# Altium schematic sheet RS232.SchDoc: RS-232
size A4; Date: 30 08 2013; Author: Rachid AKKOUCHE; CompanyName: RASoftware; DrawnBy: Rachid AKKOUCHE; Address1: 52 J03 rue de la crèche; Address2: 77100 MEAUX; Address3: FRANCE; DocumentNumber: BRA201308305C; Revision: C; SheetNumber: 5; SheetTotal: 11; Telephone: +33651604047; Email: rachid.akkouche@wanadoo.fr; Proprietaire: MDI System; Dessinepar: -; Verifiepar: -; Time: 19:00
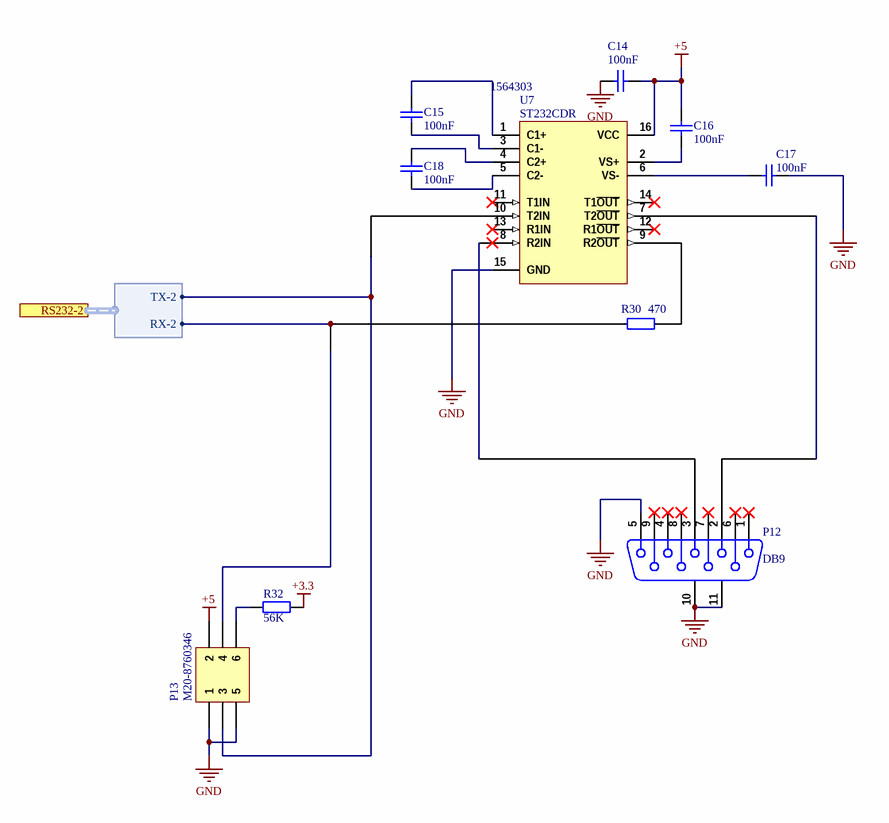
[diagram p0: RS232.SchDoc]

## Parts
C14  100nF  [C0805]  (no BOM)
C15  100nF  [C0805]  (no BOM)
C16  100nF  [C0805]  (no BOM)
C17  100nF  [C0805]  (no BOM)
C18  100nF  [C0805]  (no BOM)
P12  DB9  [SUBD9_F_V]  (no BOM)
P13  M20-8760346  [M20-2X3]  (no BOM)
R30  470  [R0805]  (no BOM)
R32  56K  [R0805]  (no BOM)
U7  ST232CDR  Supplier Part Number 1: 1564303  [SO-16]  (no BOM)

## Ports
RS232-2 (harness RS232_2)

## Harnesses
RS232_2: TX-2, RX-2

## Nets
+3.3: R32.2
+5: C14.1 C16.2 P13.2 U7.16(VCC)
GND: C14.2 C17.1 P12.5 P12.10(MH1) P12.11(MH2) P13.1 P13.5 U7.15(GND)
NetC15_1: C15.1 U7.3(C1-)
NetC15_2: C15.2 U7.1(C1+)
NetC16_1: C16.1 U7.2(VS+)
NetC17_2: C17.2 U7.6(VS-)
NetC18_1: C18.1 U7.5(C2-)
NetC18_2: C18.2 U7.4(C2+)
NetP12_2: P12.2 U7.7(T2~{OUT})
NetP12_3: P12.3 U7.8(R2IN)
NetP13_3: P13.3 U7.10(T2IN) ; port RS232-2.TX-2
NetP13_4: P13.4 R30.1 ; port RS232-2.RX-2
NetP13_6: P13.6 R32.1
NetR30_2: R30.2 U7.9(R2~{OUT})

Not connected (* = marked no-connect by the designer): P12 1* 4* 6* 7* 8* 9*; U7 11(T1IN)* 12(R1~{OUT})* 13(R1IN)* 14(T1~{OUT})*

## Notes on the sheet
- Ce document est la propriété de
- Project:
- Il ne peut être divulgué sans l'accord écrit de l'un de ses représentants dûment mandaté
- Title:
- Number:
- Date:
- Time:
- Size:
- A4
- Revision:
- Sheet
- of
- 52 J03 rue de la crèche
- Draw by:
- 77100 Meaux

## Library data of the parts
C14-C18 = Cap: Capacitor; Manufacturer: MULTICOMP; Manufacturer Part Number: MCCA000296; Supplier 1: Farnell; Supplier Part Number 1: 1759167; Stock 1: 225269; Pricing 1: 100=0,01, 500=0,008, 1000=0,006, 4000=0,005 (EUR); ComponentLink1URL: http://www.farnell.com/datasheets/1520827.pdf; ComponentLink1Description: http://www.farnell.com/datasheets/1520827.pdf
P12 = D Connector 9: Receptacle Assembly, 9 Position, Right Angle; Manufacturer: TE CONNECTIVITY / AMP; Manufacturer Part Number: 2-338313-2; Type de connecteur: Sub-D; Série: HDP-20; Genre: Embase; Nombre de contacts: 9; Nombre de rangées: 2; Plaquage du contact: Or; Matériau du contact: Bronze phosphoreux; Méthode de terminaison: A souder; Supplier 1: Farnell; Supplier Part Number 1: 1772804; RoHS: YES; Stock 1: 500; Pricing 1: 10=5,54, 50=5,31, 100=5,09, 250=4,63, 500=4,25 (EUR); ComponentLink1URL: http://www.tycoelectronics.com/commerce/DocumentDelivery/DDEController?Action=srchrtrv&DocNm=2-338313-2&DocType=Customer+View+Model&DocLang=English; ComponentLink1Description: http://www.tycoelectronics.com/commerce/DocumentDelivery/DDEController?Action=srchrtrv&DocNm=2-338313-2&DocType=Customer+View+Model&DocLang=English; ComponentLink2URL: http://www.farnell.com/cad/1599981.pdf; ComponentLink2Description: http://www.farnell.com/cad/1599981.pdf; ComponentLink3URL: http://www.farnell.com/datasheets/1643129.pdf; ComponentLink3Description: http://www.farnell.com/datasheets/1643129.pdf
P13 = Header 3X2: Header, 3-Pin, Dual row; Manufacturer: Harwin; Mounting Angle: Vertical; Pitch: 2.54 mm; Number of Positions / Contacts: 6; Supplier 1: Mouser; Supplier Part Number 1: 855-M20-8760346; Manufacturer Part Number: M20-8760346; RoHS: RoHS Compliant; Category: Headers & Wire Housings; Stock 1: 0; Pricing 1: 2250=0.285, 2500=0.213, 10000=0.211 (AUD); Contact Plating: Gold; Number of Rows: 2; Packaging: Bag; Series: M20-876; Termination Style: Solder; Mounting Style: SMD/SMT; Product Category: 2.54mm M20 SMT Connectors; Product Type: Headers - Pin Strip; Standard Pack Qty: 1000; RoHS - Mouser: Y; Minimum Order Quantity: 2250; Reeling: False; ComponentLink1URL: http://harwin.com/include/downloads/drawings/M20-876.PDF; ComponentLink1Description: http://harwin.com/include/downloads/drawings/M20-876.PDF
R30 = Res2: Resistor; Manufacturer: MULTICOMP; Manufacturer Part Number: MC0.1W08051%470RFR; Supplier 1: Farnell; Supplier Part Number 1: 2129087; RoHS: YES; Stock 1: 364995; Pricing 1: 5000=0,001 (EUR); ComponentLink1URL: http://www.farnell.com/datasheets/1636796.pdf; ComponentLink1Description: http://www.farnell.com/datasheets/1636796.pdf
R32 = Resistor 0805 56K: Resistor; Manufacturer: MULTICOMP; Manufacturer Part Number: MC0.1W08051%56KFR; Product Range: MULTICOMP - MC Series; Résistance: 56; Puissance: 100; Tolérance de résistance: ± 1%; Type de boîtier de résistance: 0805; Type de résistance: Couche épaisse; Coefficient de température: ± 100; Tension: 150; Type de packaging: Full Reel; Resistor Mounting: CMS; Resistor Terminals: (Non Disponible); Supplier 1: Farnell; RoHS: YES; Pricing 1: 5000=0,001 (EUR); MSL: (Non Applicable); ComponentLink1URL: http://www.farnell.com/datasheets/1716700.pdf; ComponentLink1Description: http://www.farnell.com/datasheets/1716700.pdf; Supplier Part Number 1: 2129258
U7 = MAX232D: Dual EIA-232 Driver/Receiver; Manufacturer: STMICROELECTRONICS; Type de driver: Driver / Récepteur de ligne; Type d'interface CI: RS232; Nombre de drivers: 2; Tension, alimentation min.: 4.5; Tension, alimentation max..: 5.5; Type de boîtier CI Driver: SOIC; Nombre de broches: 16; Température d'utilisation min: 0; Température de fonctionnement max..: 70; SVHC: No SVHC (19-Dec-2012); Courant, alimentation: 5; Gamme de tension d'alimentation: 4.5V à 5.5; Interface: RS232, V.28; Racine de la référence: 232; Taux de transfert: 220; Technologie: Transceivers; Temps de propagation: 0.3; Température de fonctionnement: 0°C à +70; Type de terminaison: SMD; Supplier 1: Farnell; Manufacturer Part Number: ST232CDR; RoHS: YES; Stock 1: 7532; Pricing 1: 1=0,8, 10=0,75, 100=0,71, 250=0,61, 500=0,56 (EUR); MSL: MSL 1 - Illimité; Nombre de récepteurs: 2; Type de boîtier: SOIC; ComponentLink1URL: http://www.st.com/web/en/resource/technical/document/datasheet/CD00001703.pdf; ComponentLink1Description: http://www.st.com/web/en/resource/technical/document/datasheet/CD00001703.pdf; ComponentLink2URL: http://www.farnell.com/cad/1725166.zip; ComponentLink2Description: http://www.farnell.com/cad/1725166.zip